# Altium schematic sheet 箱外驱动系统.SchDoc
size A4; SheetNumber: 2; SheetTotal: 9
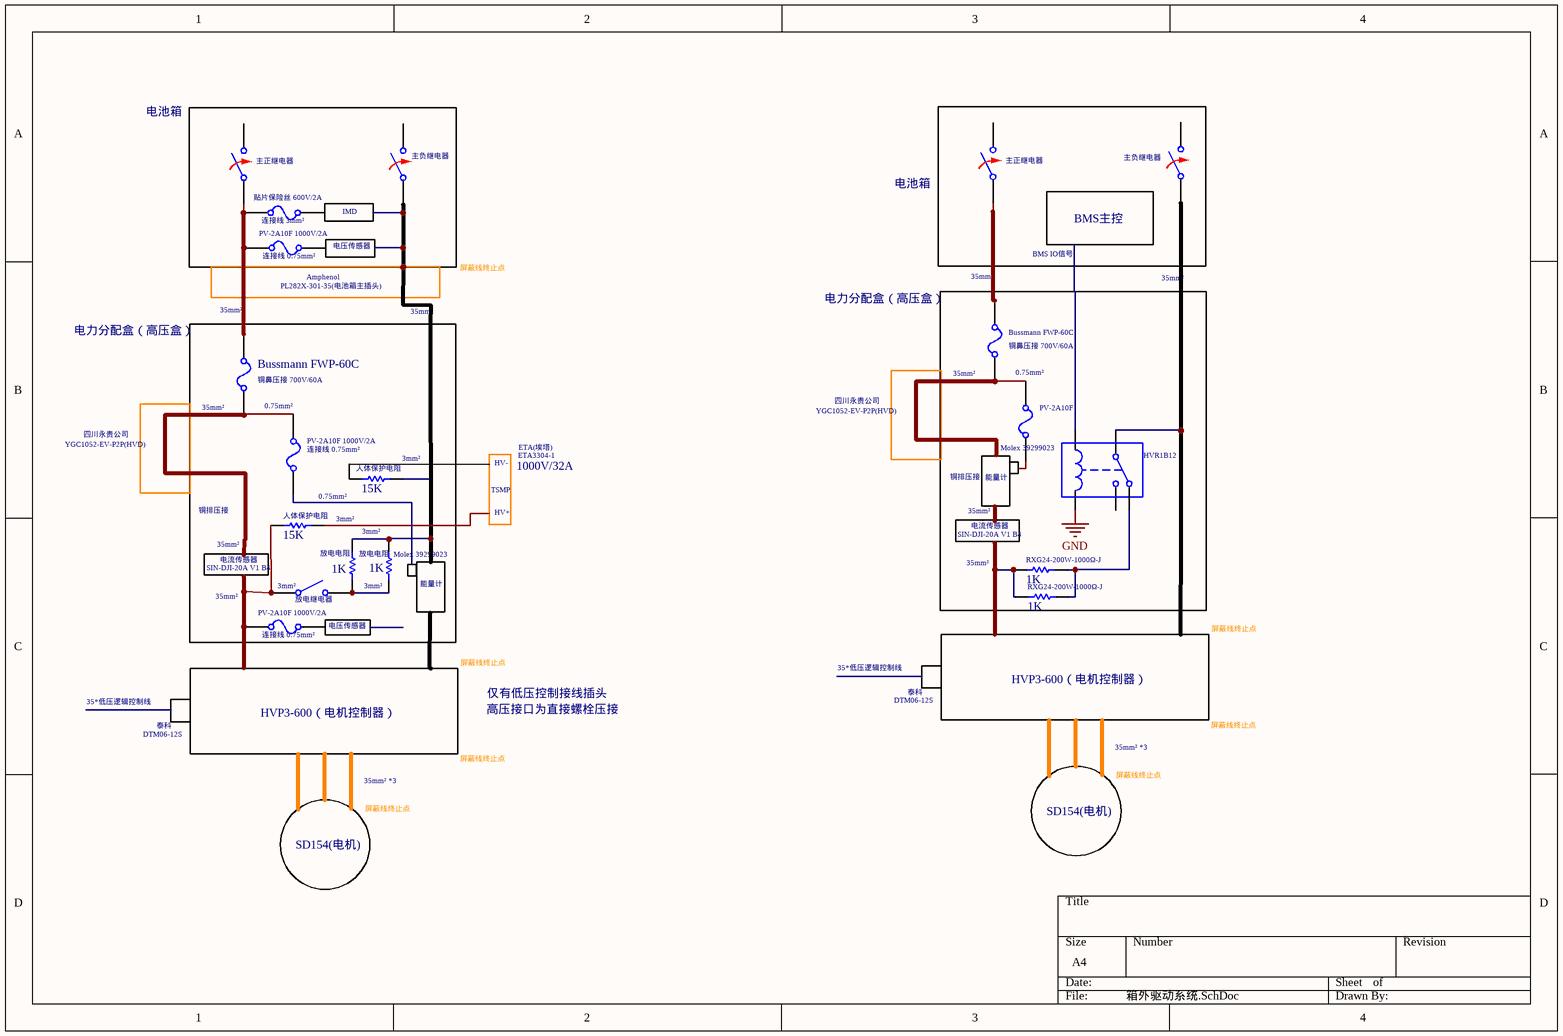
[diagram p0: 箱外驱动系统.SchDoc]

## Parts
(Parts that share a designator on the sheet are numbered #1, #2 ... from top to bottom, then left to right.)
Bussmann_FWP-60C#1  CURRENT: 铜鼻压接 700V/60A  (hidden comment: Fuse)
Bussmann_FWP-60C#2  CURRENT: 铜鼻压接 700V/60A  (hidden comment: Fuse)
HVR1B12  Single-Pole, Double-Throw Relay  (value not drawn)
PV-2A10F  连接线 0.75mm²  (value not drawn)
PV-2A10F_1000V/2A#1  连接线 0.75mm²
PV-2A10F_1000V/2A#2  连接线 0.75mm²
PV-2A10F_1000V/2A#3  连接线 0.75mm²
RXG24-200W-1000Ω-J#1  value 1K  (hidden comment: Resistor)
RXG24-200W-1000Ω-J#2  value 1K  (hidden comment: Resistor)
主正继电器#1  Switch Normally Opened  (value not drawn)
主正继电器#2  Switch Normally Opened  (value not drawn)
主负继电器#1  Switch Normally Opened  (value not drawn)
主负继电器#2  Switch Normally Opened  (value not drawn)
人体保护电阻#1  value 15K  (hidden comment: Resistor)
人体保护电阻#2  value 15K  (hidden comment: Resistor)
放电电阻#1  value 1K  (hidden comment: Resistor)
放电电阻#2  value 1K  (hidden comment: Resistor)
放电继电器  Single-Pole, Single-Throw Switch  (value not drawn)
贴片保险丝_600V/2A  连接线 3mm²

## Sub-sheets
电池箱 = 电池箱: no entries
电池箱 = 电力分配盒（高压盒）: no entries
电池箱 = IMD: no entries
电池箱 = 电压传感器: no entries
电池箱 = YGC1052-EV-P2P(HVD): no entries
电池箱 = PL282X-301-35(电池箱主插头): no entries
电池箱 = 能量计: no entries
电池箱 = TSMP: no entries
电池箱 = HVP3-600（电机控制器）: no entries
电池箱 = 电压传感器: no entries
电池箱 = 电池箱: no entries
电池箱 = 电力分配盒（高压盒）: no entries
电池箱 = YGC1052-EV-P2P(HVD): no entries
电池箱 = 能量计: no entries
电池箱 = HVP3-600（电机控制器）: no entries

## Nets
GND: HVR1B12.5
NetBussmann_FWP-60C#1_1: Bussmann_FWP-60C#1.1 主正继电器#1.1
NetBussmann_FWP-60C#1_2: Bussmann_FWP-60C#1.2 PV-2A10F.2
NetBussmann_FWP-60C#2_1: Bussmann_FWP-60C#2.1 PV-2A10F_1000V/2A#1.1 主正继电器#2.1 贴片保险丝_600V/2A.1
NetBussmann_FWP-60C#2_2: Bussmann_FWP-60C#2.2 PV-2A10F_1000V/2A#2.2
NetHVR1B12_1: HVR1B12.1 主负继电器#1.1
NetHVR1B12_3: HVR1B12.3 RXG24-200W-1000Ω-J#1.1 RXG24-200W-1000Ω-J#2.1
NetPV-2A10F_1000V/2A#3_1: PV-2A10F_1000V/2A#3.1 人体保护电阻#2.2 放电继电器.1
NetRXG24-200W-1000Ω-J#1_2: RXG24-200W-1000Ω-J#1.2 RXG24-200W-1000Ω-J#2.2
Net主负继电器#2_1: 主负继电器#2.1 放电电阻#1.2 放电电阻#2.2
Net放电电阻#1_1: 放电电阻#1.1 放电电阻#2.1 放电继电器.2

Not connected (* = marked no-connect by the designer): HVR1B12 2 4; PV-2A10F 1; PV-2A10F_1000V/2A#1 2; PV-2A10F_1000V/2A#2 1; PV-2A10F_1000V/2A#3 2; 主正继电器#1 2; 主正继电器#2 2; 主负继电器#1 2; 主负继电器#2 2; 人体保护电阻#1 1 2; 人体保护电阻#2 1; 贴片保险丝_600V/2A 2

## Notes on the sheet
- BMS主控
- 35mm²
- (near PV-2A10F_1000V/2A#1) Amphenol
- 屏蔽线终止点
- (near Bussmann_FWP-60C#1) 35mm²
- BMS IO信号
- 0.75mm²
- 四川永贵公司
- (near Bussmann_FWP-60C#2) 35mm²
- ETA(埃塔)
- (near PV-2A10F) Molex 39299023
- 铜排压接
- (near 人体保护电阻#1) 0.75mm²
- 3mm²
- (near 人体保护电阻#1) 3mm²
- HV+
- HV-
- 1000V/32A
- ETA3304-1
- SIN-DJI-20A V1 B4
- 电流传感器
- (near 放电继电器) 3mm²
- (near 放电电阻#1) 3mm²
- (near 放电电阻#2) 3mm²
- (near 放电电阻#2) Molex 39299023
- (near RXG24-200W-1000Ω-J#1) SIN-DJI-20A V1 B4
- (near RXG24-200W-1000Ω-J#1) 35mm²
- (near RXG24-200W-1000Ω-J#1) 电流传感器
- 35*低压逻辑控制线
- 高压接口为直接螺栓压接
- 仅有低压控制接线插头
- DTM06-12S
- 泰科
- 35mm² *3
- SD154(电机)

## Library data of the parts
Bussmann_FWP-60C#1 Bussmann_FWP-60C#2 = Fuse: RESISTANCE: 1m; SimulationGenericComponent: True
HVR1B12 = SPDT Relay: L_C: 1u; R_C: 100; RON: 1; ROFF: 1e12; ION: 1m; IOFF: 0; SimulationGenericComponent: True
PV-2A10F PV-2A10F_1000V/2A#1-PV-2A10F_1000V/2A#3 贴片保险丝_600V/2A = Fuse: RESISTANCE: 1m; SimulationGenericComponent: True; CURRENT: 1
RXG24-200W-1000Ω-J#1 RXG24-200W-1000Ω-J#2 人体保护电阻#1 人体保护电阻#2 放电电阻#1 放电电阻#2 = Resistor: TC1: 0; SimulationGenericComponent: True; TC2: 0
主正继电器#1 主正继电器#2 主负继电器#1 主负继电器#2 = SW NO: closed: 0; Rclosed: 1m; Ropen: 1Meg; SimulationGenericComponent: True
放电继电器 = SPST SW: closed: 0; Rclosed: 1m; Ropen: 1Meg; SimulationGenericComponent: True